# Altium schematic sheet PWR_LD1117S33.SchDoc
size A3; SheetNumber: 8; SheetTotal: 10
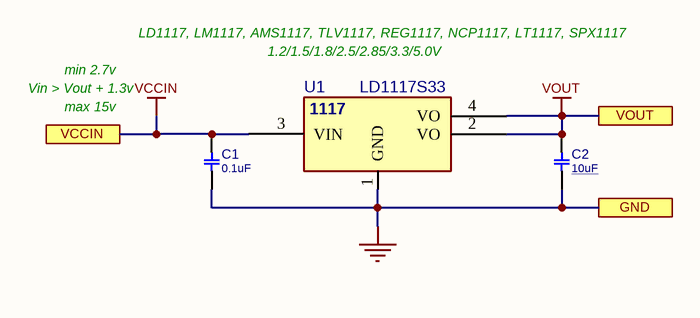
[diagram p0: PWR_LD1117S33.SchDoc]

## Parts
C1  0.1uF  [C0402]
C2  10uF  [C0402]
U1  LD1117S33  [SOT223_4]

## Ports
GND, VCCIN, VOUT

## Nets
GND: C1.2 C2.2 U1.1(GND) ; port GND
VCCIN: C1.1 U1.3(VIN) ; port VCCIN
VOUT: C2.1 U1.2(VO) U1.4(VO) ; port VOUT

## Notes on the sheet
- min 2.7v
- LD1117, LM1117, AMS1117, TLV1117, REG1117, NCP1117, LT1117, SPX1117
- (near U1) 1.2/1.5/1.8/2.5/2.85/3.3/5.0V
- Vin > Vout + 1.3v
- max 15v
- (in symbol VREG_1117_SOT223) 1117

## Library data of the parts
C1 = CAP_SMD_MLCC_100n50T: CAP, MLCC; PARAM: X7R, 10%; PARAM2: 50V; MANF: -; ASSEMBLY: ASSEMBLY; PRICE: 100= 5$; VALUE: 0.1uF; MANF_P#: -
C2 = CAP_SMD_MLCC: CAP, MLCC; PARAM: X5R, 20%; PARAM2: 10v; PRICE: 100= 1$; DESC: CAP, MLCC; MANF_P#: -; MANF: -; ASSEMBLY: ASSEMBLY; VALUE: 10uF
U1 = VREG_1117_SOT223: REG, Linear, LDO1V, 0.8A, SOT-223; MANF_P#: LD1117, LM1117, AMS1117, TLV1117, REG1117, NCP1117, LT1117, SPX1117; MANF: TI, ON, ST; PARAM2: 1.2/1.5/1.8/2.5/2.85/3.3/5V; PARAM: LDO1V, 0.8A; VALUE: LD1117S33